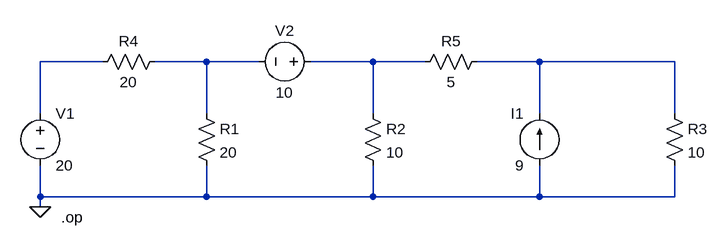
[diagram p0: schematic CH03-KP2-13.asc]
CH03-KP2-13.asc, the LTspice schematic file:
Version 4
SHEET 1 880 680
WIRE -128 272 -224 272
WIRE 32 272 -48 272
WIRE 112 272 32 272
WIRE 288 272 192 272
WIRE 368 272 288 272
WIRE 544 272 448 272
WIRE 752 272 544 272
WIRE -224 352 -224 272
WIRE 32 352 32 272
WIRE 288 352 288 272
WIRE 544 352 544 272
WIRE 752 352 752 272
WIRE -224 480 -224 432
WIRE 32 480 32 432
WIRE 32 480 -224 480
WIRE 288 480 288 432
WIRE 288 480 32 480
WIRE 544 480 544 432
WIRE 544 480 288 480
WIRE 752 480 752 432
WIRE 752 480 544 480
WIRE -224 496 -224 480
FLAG -224 496 0
DATAFLAG 32 272 "$"
DATAFLAG 288 272 "$"
DATAFLAG 544 272 "$"
SYMBOL res 16 336 R0
SYMATTR InstName R1
SYMATTR Value 20
SYMBOL res 272 336 R0
SYMATTR InstName R2
SYMATTR Value 10
SYMBOL res 736 336 R0
SYMATTR InstName R3
SYMATTR Value 10
SYMBOL res -32 256 R90
WINDOW 0 0 56 VBottom 2
WINDOW 3 32 56 VTop 2
SYMATTR InstName R4
SYMATTR Value 20
SYMBOL res 464 256 R90
WINDOW 0 0 56 VBottom 2
WINDOW 3 32 56 VTop 2
SYMATTR InstName R5
SYMATTR Value 5
SYMBOL voltage -224 336 R0
SYMATTR InstName V1
SYMATTR Value 20
SYMBOL voltage 208 272 R90
WINDOW 0 -32 56 VBottom 2
WINDOW 3 32 56 VTop 2
SYMATTR InstName V2
SYMATTR Value 10
SYMBOL current 544 432 R180
WINDOW 0 24 80 Left 2
WINDOW 3 24 0 Left 2
SYMATTR InstName I1
SYMATTR Value 9
TEXT -192 512 Left 2 !.op

The netlist it stands for:
* CH03-KP2-13.asc
R1 N002 0 20
R2 N003 0 10
R3 N004 0 10
R4 N002 N001 20
R5 N004 N003 5
V1 N001 0 20
V2 N003 N002 10
I1 0 N004 9
.op
.backanno
.end